# EAGLE design GuardBunny (EAGLE 7.5.0)
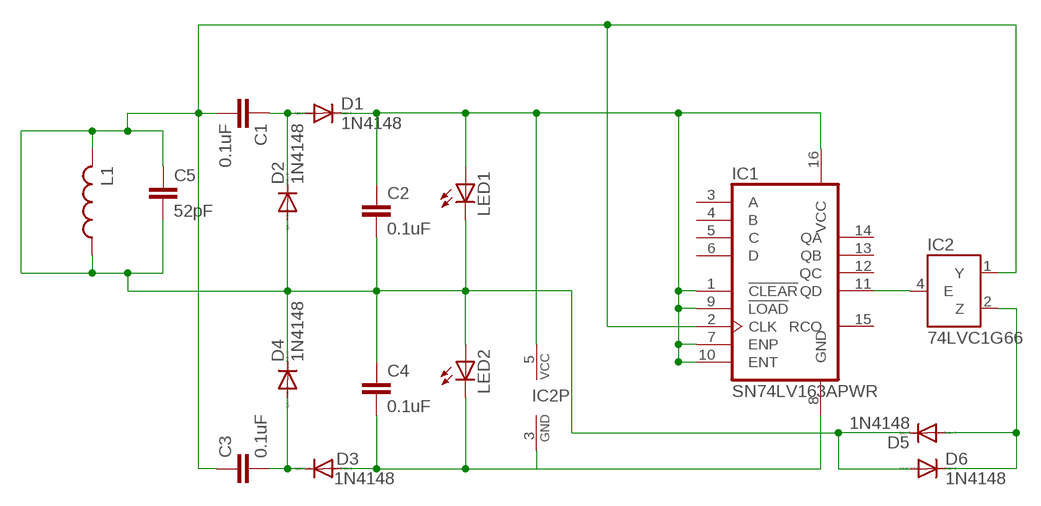
[diagram p0: schematic, sheet 1]

## Parts
C1  0.1uF  C-EUC0603  [C0603]
C2  0.1uF  C-EUC0603  [C0603]
C3  0.1uF  C-EUC0603  [C0603]
C4  0.1uF  C-EUC0603  [C0603]
C5  52pF  C-EUC0603  [C0603]
D1  1N4148  DIODE-SOD523  [SOD523]
D2  1N4148  DIODE-SOD523  [SOD523]
D3  1N4148  DIODE-SOD523  [SOD523]
D4  1N4148  DIODE-SOD523  [SOD523]
D5  1N4148  DIODE-SOD523  [SOD523]
D6  1N4148  DIODE-SOD523  [SOD523]
IC1  SN74LV163APWR  [TSSOP16]
IC2  74LVC1G66  741G66DBV  [SOT23-5]
L1  L-USL2012C  [L2012C]
LED1  LEDCHIP-LED0603  [CHIP-LED0603]
LED2  LEDCHIP-LED0603  [CHIP-LED0603]

## Nets
GND: C4.2 D3.A IC1.8(GND) IC2.3(GND) LED2.C
N$1: C1.2 C2.2 C3.1 C4.1 C5.1 C5.2 D2.A D4.C D5.C D6.A IC1.2(CLK) IC2.1(Y) L1.1 L1.2 LED1.C LED2.A
N$3: C1.1 D1.A D2.C
N$4: IC1.11(QD) IC2.4(E)
N$7: C3.2 D3.C D4.A
N$12: D5.A D6.C IC2.2(Z)
VCC: C2.1 D1.C IC1.1(!CLEAR) IC1.7(ENP) IC1.9(!LOAD) IC1.10(ENT) IC1.16(VCC) IC2.5(VCC) LED1.A
Unconnected: IC1.3(A) IC1.4(B) IC1.5(C) IC1.6(D) IC1.12(QC) IC1.13(QB) IC1.14(QA) IC1.15(RCO)

## Library data of the parts
C1-C5 = rcl:C-EU: CAPACITOR, European symbol
D1-D6 = diode:DIODE-: DIODE
IC1 = BunnyForce2:SN74LV163APWR
IC2 = 74xx-little-us:74*1G66: Single Analog / Bilateral Switch Source: http://www.semiconductors.philips.com/acrobat_download/datasheets/74HC_HCT1G66_3.pdf
L1 = rcl:L-US: INDUCTOR, American symbol
LED1 LED2 = led:LED: LED OSRAM: - CHIPLED LG R971, LG N971, LY N971, LG Q971, LY Q971, LO R971, LY R971 LH N974, LH R974 LS Q976, LO Q976, LY Q976 LO Q996 - Hyper CHIPLED LW Q18S LB Q993, LB Q99A, LB R99A - SideLED LS A670, LO A670, LY A670, LG A670, LP A670 LB A673, LV A673, LT A673, LW A673 LH A674 LY A675 LS A676, LA A676, LO A676, LY A676, LW A676 LS A679, LY A679, LG A679 - Hyper Micro SIDELED® LS Y876, LA Y876, LO Y876, LY Y876 LT Y87S - SmartLED LW L88C, LW L88S LB L89C, LB L89S, LG L890 LS L89K, LO L89K, LY L89K LS L896, LA L896, LO L896, LY L896 - TOPLED LS T670, LO T670, LY T670, LG T670, LP T670 LSG T670, LSP T670, LSY T670, LOP T670, LYG T670 LG T671, LOG T671, LSG T671 LB T673, LV T673, LT T673, LW T673 LH T674 LS T676, LA T676, LO T676, LY T676, LB T676, LH T676, LSB T676, LW T676 LB T67C, LV T67C, LT T67C, LS T67K, LO T67K, LY T67K, LW E67C LS E67B, LA E67B, LO E67B, LY E67B, LB E67C, LV E67C, LT E67C LW T67C LS T679, LY T679, LG T679 LS T770, LO T770, LY T770, LG T770, LP T770 LB T773, LV T773, LT T773, LW T773 LH T774 LS E675, LA E675, LY E675, LS T675 LS T776, LA T776, LO T776, LY T776, LB T776 LHGB T686 LT T68C, LB T68C - Hyper Mini TOPLED® LB M676 - Mini TOPLED Santana® LG M470 LS M47K, LO M47K, LY M47K Source: http://www.osram.convergy.de LUXEON: - LUMILED® LXK2-PW12-R00, LXK2-PW12-S00, LXK2-PW14-U00, LXK2-PW14-V00 LXK2-PM12-R00, LXK2-PM12-S00, LXK2-PM14-U00 LXK2-PE12-Q00, LXK2-PE12-R00, LXK2-PE12-S00, LXK2-PE14-T00, LXK2-PE14-U00 LXK2-PB12-K00, LXK2-PB12-L00, LXK2-PB12-M00, LXK2-PB14-N00, LXK2-PB14-P00, LXK2-PB14-Q00 LXK2-PR12-L00, LXK2-PR12-M00, LXK2-PR14-Q00, LXK2-PR14-R00 LXK2-PD12-Q00, LXK2-PD12-R00, LXK2-PD12-S00 LXK2-PH12-R00, LXK2-PH12-S00 LXK2-PL12-P00, LXK2-PL12-Q00, LXK2-PL12-R00 Source: www.luxeon.com KINGBRIGHT: KA-3528ASYC Source: www.kingbright.com

## Board
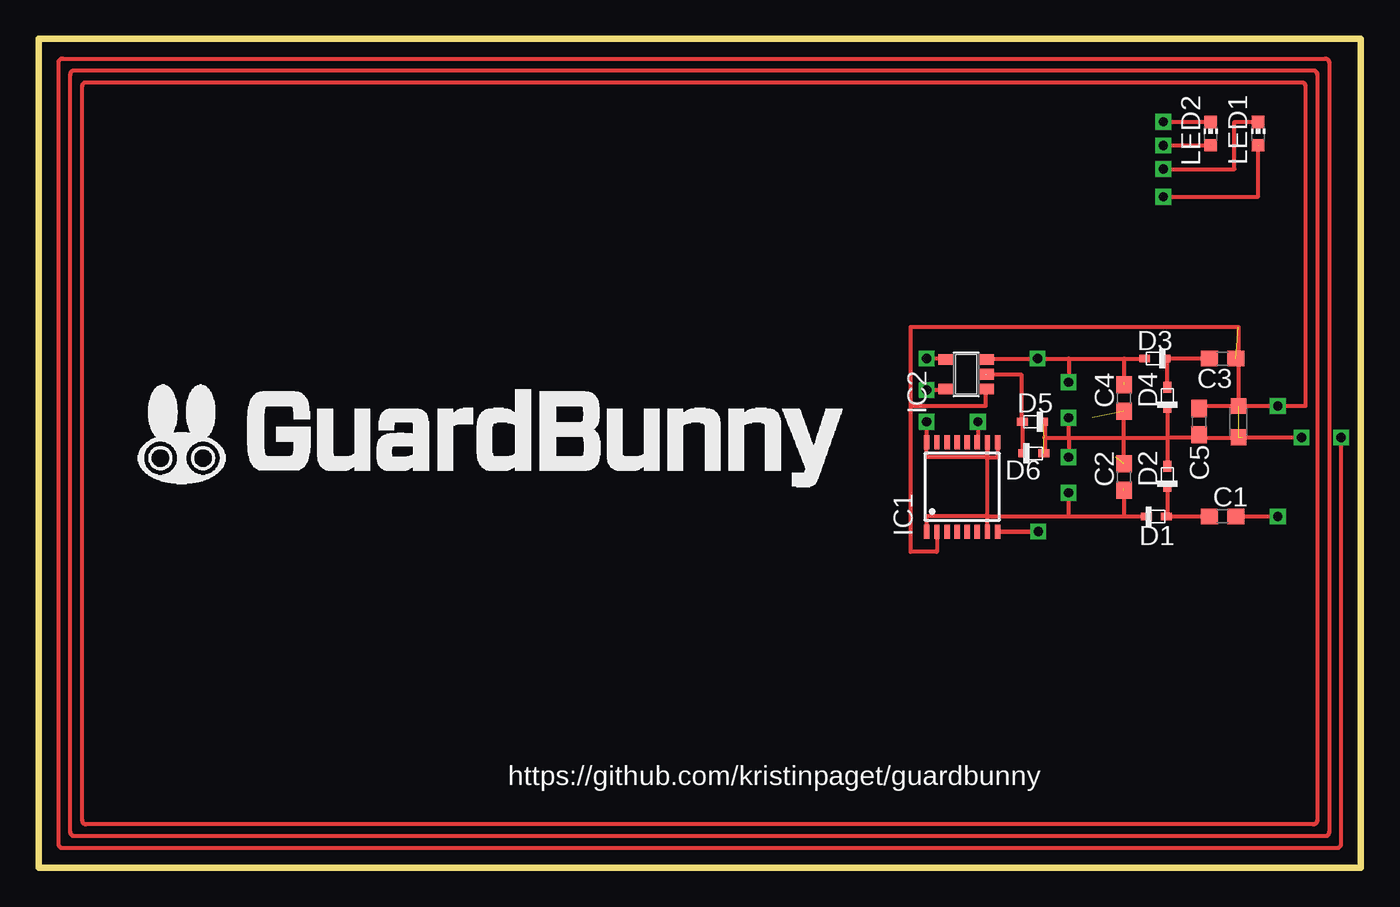
[diagram p1: board, top side]
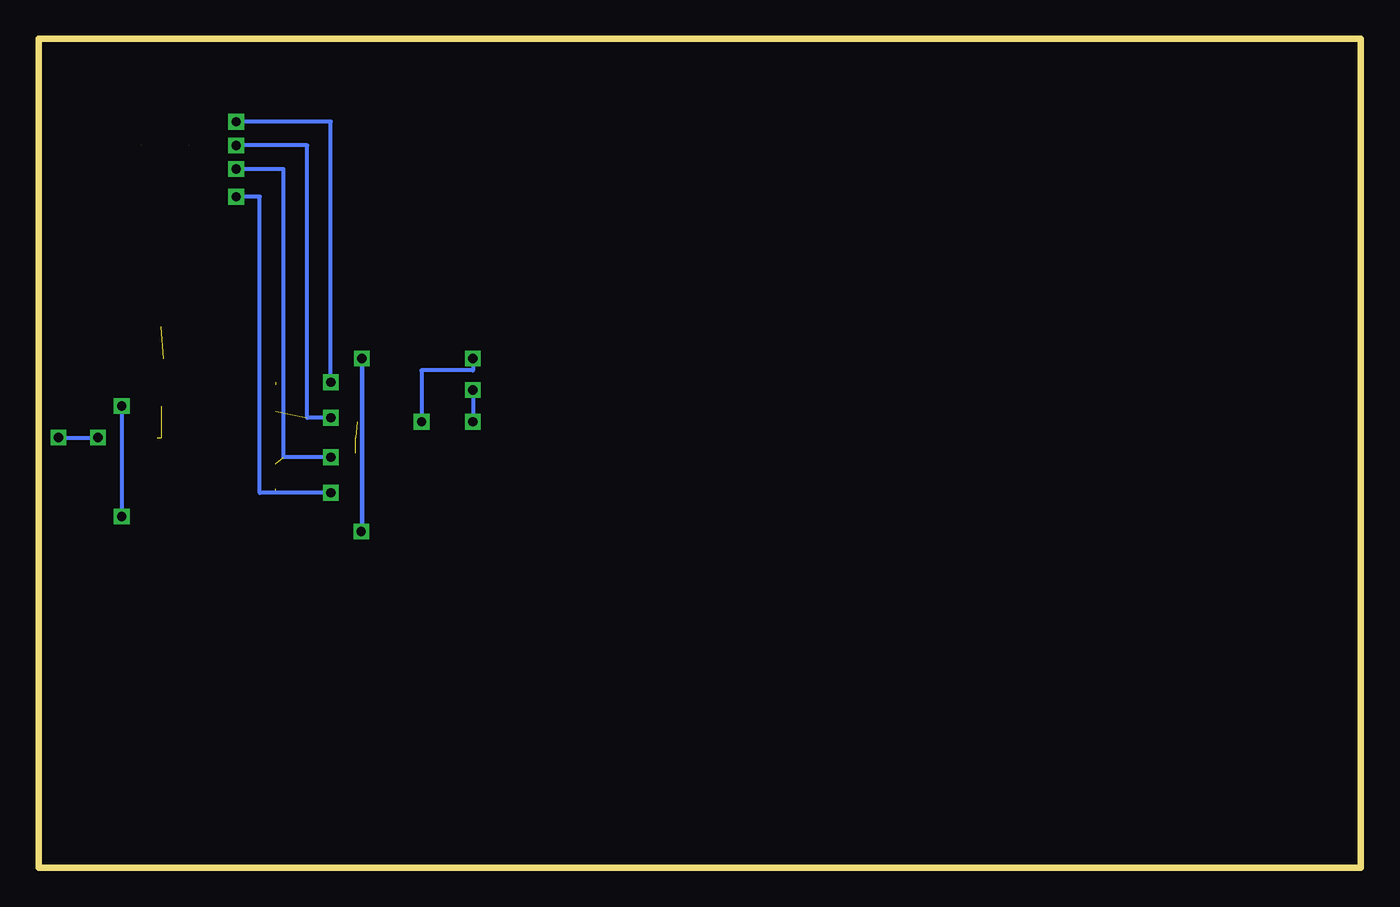
[diagram p2: board, bottom side, seen from below]

Size 85.09 x 53.34 mm. Coordinates in mm from the lower left corner, seen from the top.
Outline: 0,0 0,53.34 85.09,53.34 85.09,0 0,0
Copper layers (1*16): Top 0.035mm / dielectric 1.5mm / Bottom 0.035mm
Design rules "default": minimum track width 10mil, minimum drill 24mil, track to track 8mil, track to pad 8mil, pad to pad 8mil, via to via 8mil, smd to smd 8mil, copper to edge 40mil, drill to drill 8mil, minimum pad ring 10mil, minimum via ring 8mil, stop-mask expansion 4mil, vias tented up to drill 0mil, thermal gap 10mil

### Footprints (pad centres in the part's own frame; a part is rotated, then mirrored left to right if it is on the bottom)
C0603 = smd 1.1 x 1: 1 -0.85,0; 2 0.85,0
SOD523 = smd 0.7 x 0.5: A 0.7,0; C -0.6,0
TSSOP16 = smd 0.9 x 0.35: 1 -2.875,2.275; 2 -2.875,1.625; 3 -2.875,0.975; 4 -2.875,0.325; 5 -2.875,-0.325; 6 -2.875,-0.975; 7 -2.875,-1.625; 8 -2.875,-2.275; 9 2.875,-2.275; 10 2.875,-1.625; 11 2.875,-0.975; 12 2.875,-0.325; 13 2.875,0.325; 14 2.875,0.975; 15 2.875,1.625; 16 2.875,2.275
SOT23-5 = smd 0.69 x 0.99: 1 -0.95,-1.29; 2 0,-1.29; 3 0.95,-1.29; 4 0.95,1.3; 5 -0.95,1.3
L2012C = smd 1 x 1: 1 -1,0; 2 1,0
CHIP-LED0603 = smd 0.8 x 0.8: A 0,-0.75; C 0,0.75

### Placement (x,y rotation side)
C1  76.2,22.61 0 top
C2  69.85,25.15 90 top
C3  76.2,32.77 180 top
C4  69.85,30.23 90 top
C5  74.68,28.7 270 top
D1  71.88,22.61 0 top
D2  72.64,25.15 90 top
D3  71.88,32.77 180 top
D4  72.64,30.23 90 top
D5  64.01,28.7 180 top
D6  64.01,26.67 0 top
IC1  59.44,24.51 90 top
IC2  59.69,31.75 90 top
L1  77.22,28.7 90 top
LED1  78.49,47.24 0 top
LED2  75.44,47.24 0 top

### Tracks (layer width: path | path; a pad name or v marks a point on that pad's centre or on a via)
GND  (via drill 0.6)  (1 unrouted)
  Top 0.254: 69.85,32.77 D3.A | 69.85,32.77 69.85,31.24 | IC2.3 60.98,32.77 v64.29,32.77 66.29,32.77 | 66.29,32.77 69.85,32.77 | 66.29,32.77 v66.29,31.24 | v72.39,48.01 v72.39,47.99 LED2.C
  Top 0.305: IC1.8 v64.34,21.64
  Bottom 0.254: v66.29,31.24 66.29,48.01 v72.39,48.01
  Bottom 0.305: v64.34,21.64 64.29,21.64 v64.29,32.77
N$1  (via drill 0.6)  (9 unrouted)
  Top 0.254: 64.71,28.7 D5.C | D4.C 72.64,27.69 | 72.64,27.69 D2.A | C5.2 74.68,27.69 | 74.68,27.69 72.64,27.69 | 66.29,27.69 72.64,27.69 | 74.68,27.69 77.22,27.69 | 66.29,27.69 v66.29,26.42 | v72.39,44.96 76.96,44.96 76.96,47.99 LED1.C | 64.71,27.69 66.29,27.69 | 66.29,27.69 v66.29,28.96 | v72.39,46.48 75.44,46.48 | v83.82,27.69 83.82,1.52 arc-90 83.57,1.27 1.52,1.27 arc-90 1.27,1.52 1.27,51.82 arc-90 1.52,52.07 82.8,52.07 arc-90 83.06,51.82 83.06,2.29 arc-90 82.8,2.03 2.29,2.03 arc-90 2.03,2.29 2.03,51.05 arc-90 2.29,51.31 82.04,51.31 arc-90 82.3,51.05 82.3,3.05 arc-90 82.04,2.79 3.05,2.79 arc-90 2.79,3.05 2.79,50.29 arc-90 3.05,50.55 81.28,50.55 arc-90 81.53,50.29 81.53,29.72 v79.76,29.72 74.68,29.72 C5.1 | C1.2 v79.76,22.61 | L1.2 77.22,34.8 56.13,34.8 56.13,29.72 | IC1.2 57.81,20.32 56.13,20.32 56.13,29.72 | 56.13,29.72 60.96,29.72 60.96,30.8 IC2.1 | v81.28,27.69 77.47,27.69
  Bottom 0.254: v66.29,26.42 69.34,26.42 69.34,44.96 v72.39,44.96 | v66.29,28.96 67.82,28.96 67.82,46.48 v72.39,46.48 | v83.82,27.69 v81.28,27.69 | v79.76,29.72 v79.76,22.61
N$3
  Top 0.254: C1.1 D1.A 72.64,22.61 D2.C
N$4  (via drill 0.6)
  Top 0.254: IC2.4 58.39,32.77 v57.15,32.77 | v60.45,28.7 60.45,27.39 IC1.11
  Bottom 0.254: v57.15,32.77 57.15,32 60.45,32 v60.45,28.7
N$7
  Top 0.254: C3.2 D3.C 72.64,32.77 D4.A
N$10
  Top 0.254: 69.85,26.16 69.85,28.96
N$12
  Top 0.254: D6.C 63.31,26.67 D5.A 63.25,28.7 63.25,31.75 IC2.2
N$16
  Top 0.254: 64.77,28.7 64.77,26.67
VCC  (via drill 0.6)  (2 unrouted)
  Top 0.254: 69.85,22.61 D1.C | 69.85,24.38 69.85,22.61 | 61.06,22.61 66.29,22.61 | 66.29,22.61 69.85,22.61 | 61.06,22.61 IC1.10 61.06,26.42 | 61.06,26.42 61.72,26.42 61.72,27.39 IC1.9 | 61.06,26.42 57.15,26.42 IC1.16 | IC1.7 61.06,22.61 | 61.06,22.61 57.15,22.61 IC1.1 | IC2.5 58.39,30.73 v57.15,30.73 | v57.15,28.7 IC1.16 | IC1.16 | 66.29,22.61 v66.29,24.13 | v72.39,43.18 78.49,43.18 78.49,46.48
  Bottom 0.254: v57.15,30.73 v57.15,28.7 | v66.29,24.13 70.87,24.13 70.87,43.18 v72.39,43.18

### Text on the board
tPlace: https://github.com/kristinpaget/guardbunny